# EAGLE design team_flag_jig (EAGLE 6.5.0)
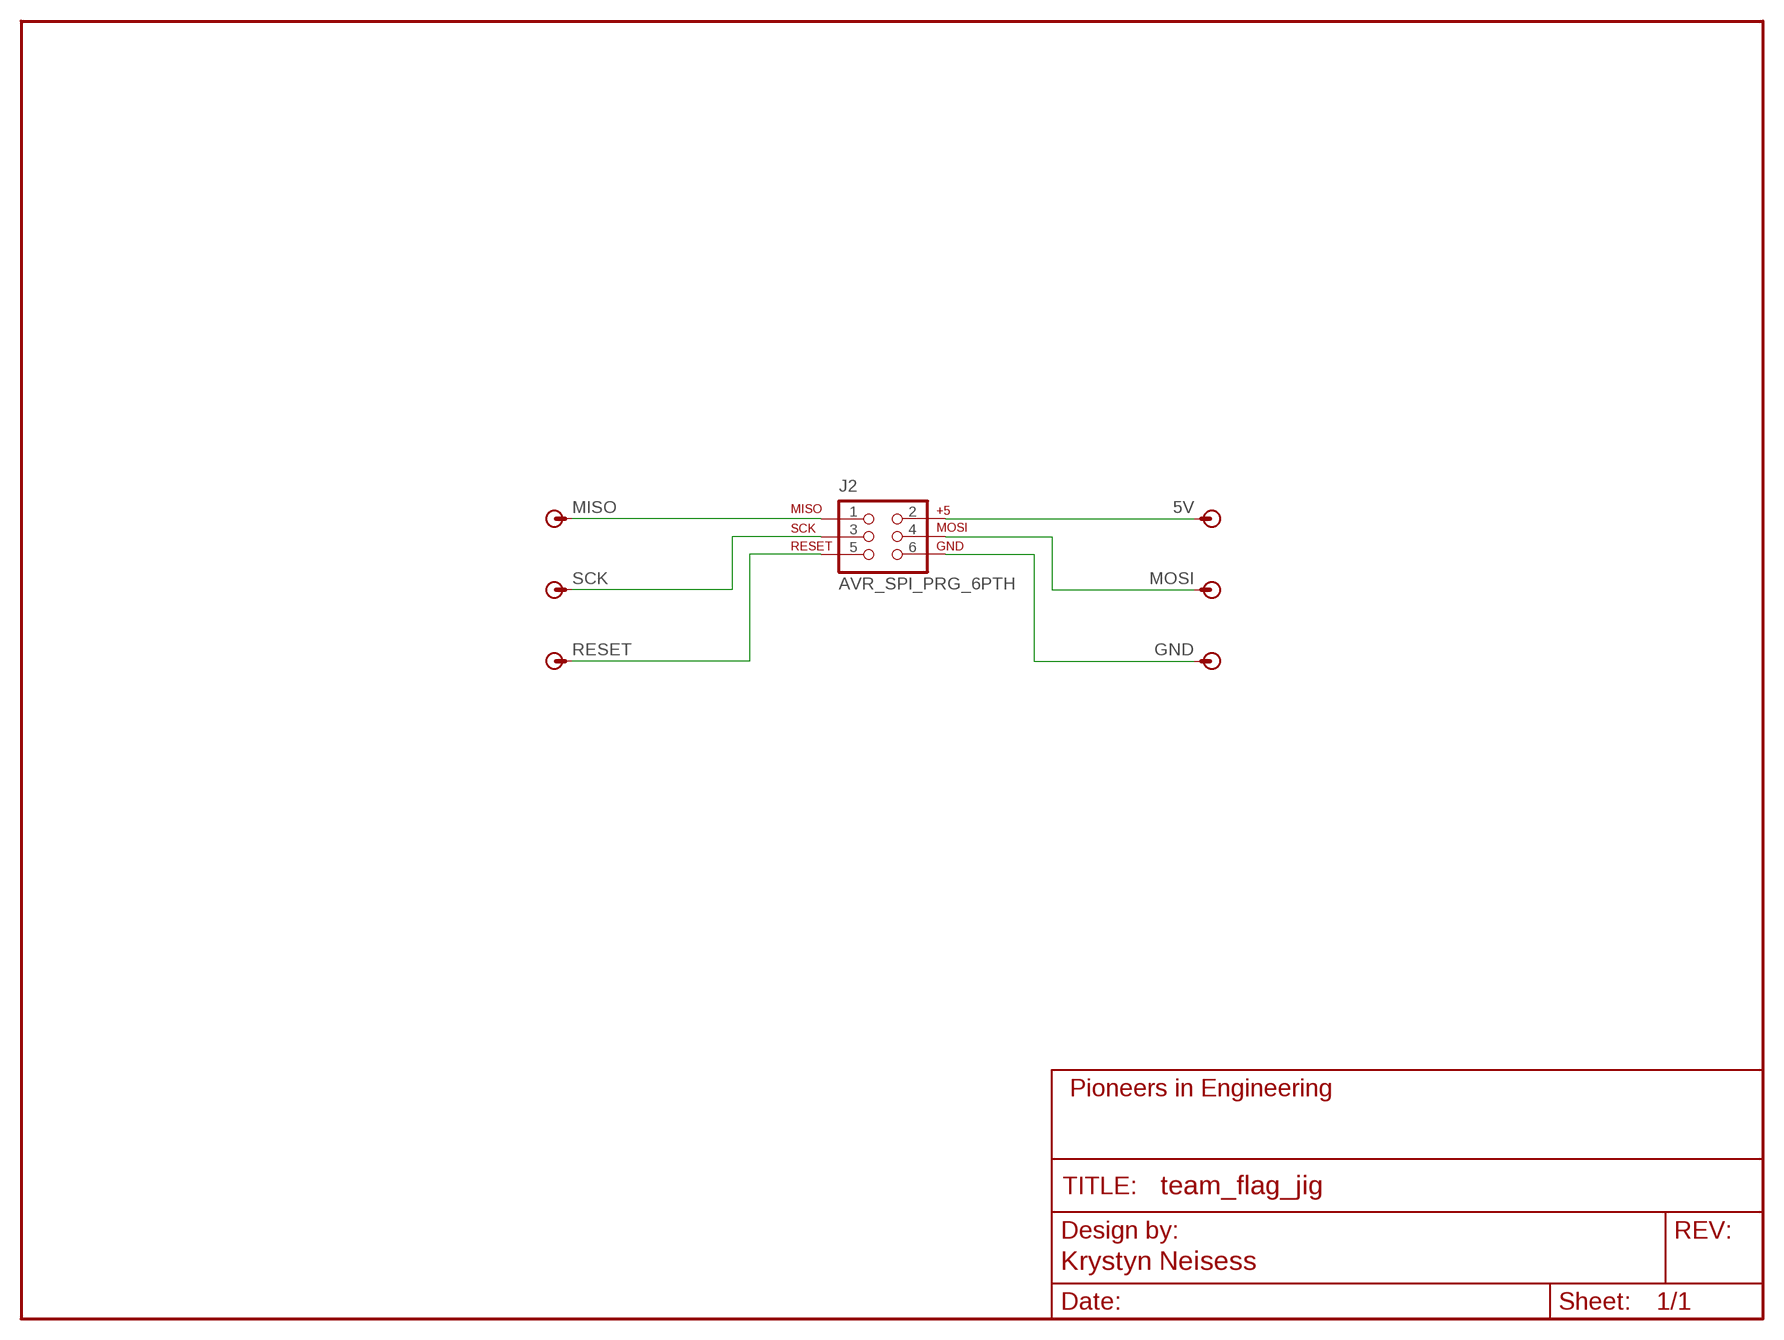
[diagram p0: schematic, sheet 1]
FRAME1 (FRAME-LETTER): AUTHOR: Krystyn Neisess; REVISION: 3A

## Parts
5V  POGO_PIN  [POGO_PIN_394]
GND  POGO_PIN  [POGO_PIN_394]
J2  AVR_SPI_PRG_6PTH  [2X3]
MISO  POGO_PIN  [POGO_PIN_394]
MOSI  POGO_PIN  [POGO_PIN_394]
RESET  POGO_PIN  [POGO_PIN_394]
SCK  POGO_PIN  [POGO_PIN_394]

## Nets
5V: 5V.POGO_PIN J2.2
A: GND.POGO_PIN J2.6
MISO: J2.1 MISO.POGO_PIN
MOSI: J2.4 MOSI.POGO_PIN
RESET: J2.5 RESET.POGO_PIN
SCK: J2.3 SCK.POGO_PIN

## Library data of the parts
5V GND MISO MOSI RESET SCK = pie:POGO_PIN: Pogo Pin Mounting/Probing Pad; PIE-INT-REF-NUM: POGO-PIN
J2 = pie:AVR_SPI_PRG_6: AVR ISP 6 Pin This is the reduced ISP connector for AVR programming. Common on Arduino. This footprint will take up less PCB space and can be used with a 10-pin to 6-pin adapter such as SKU: BOB-08508; PIE-INT-REF-NUM: BULK-STOCK

## Board
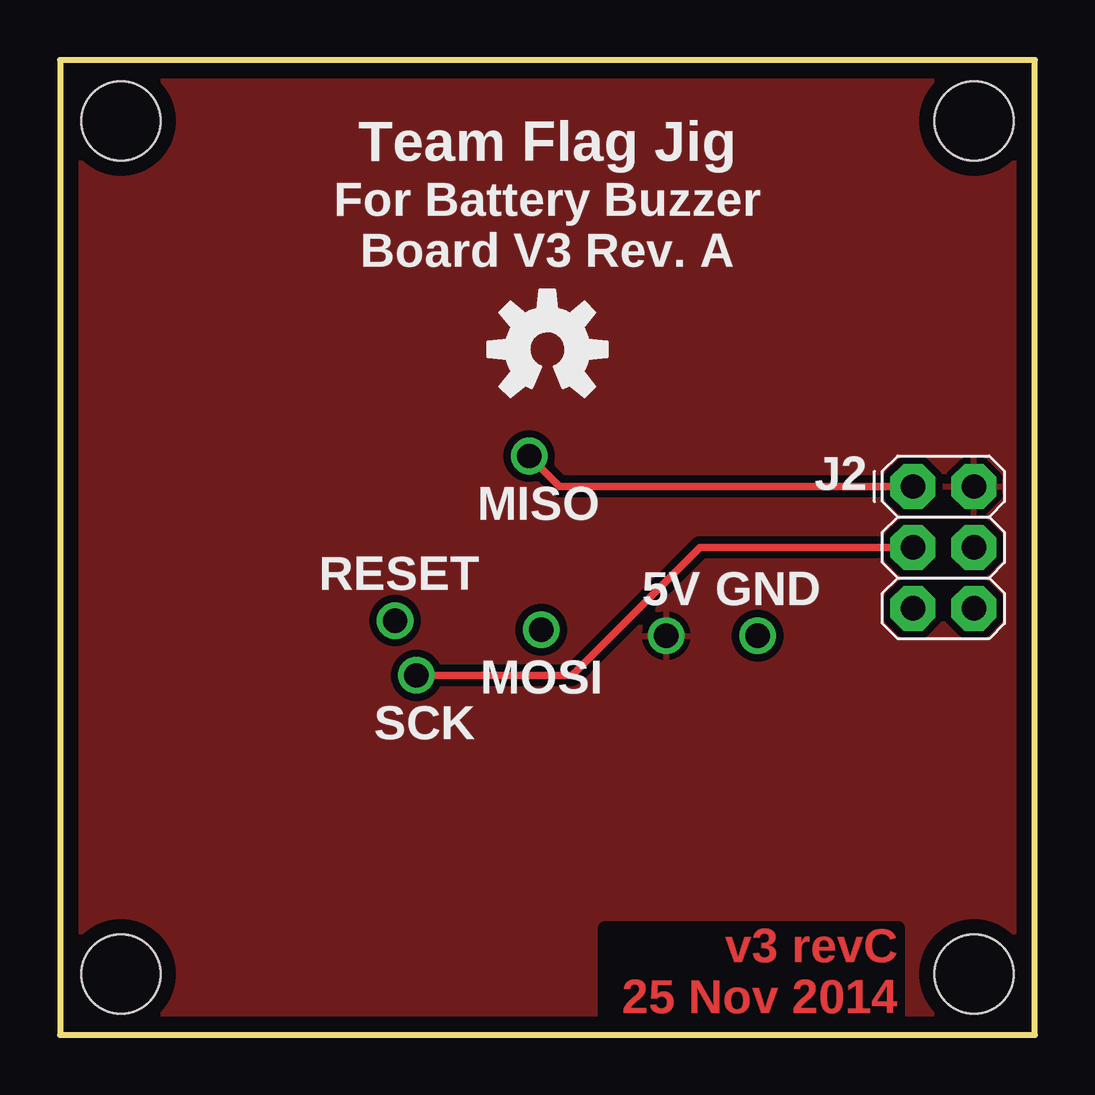
[diagram p1: board, top side]
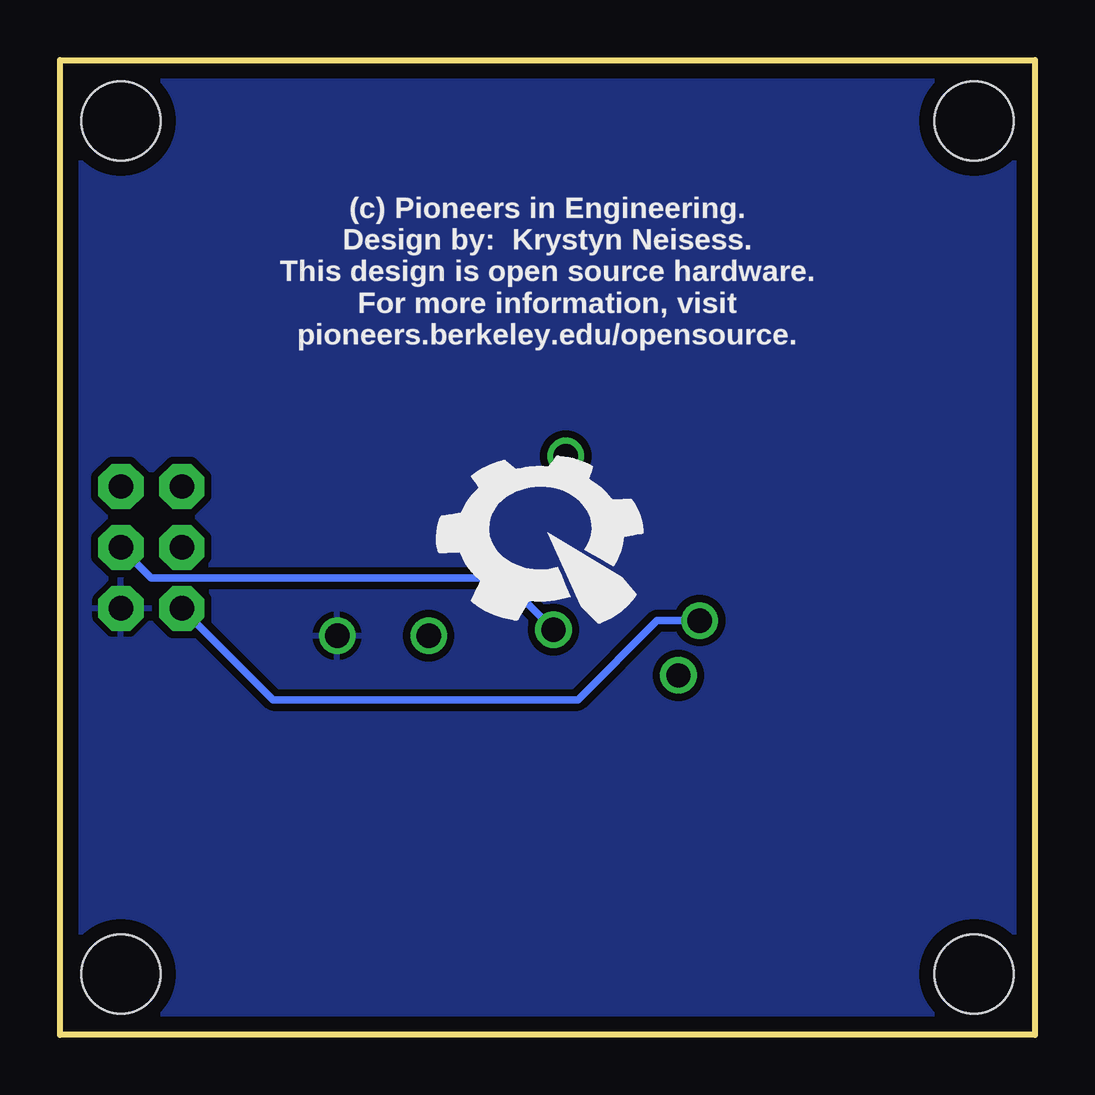
[diagram p2: board, bottom side, seen from below]

Size 40.64 x 40.64 mm. Coordinates in mm from the lower left corner, seen from the top.
Outline: 0,0 40.64,0 40.64,40.64 0,40.64 0,0
Copper layers (1*16): Top 2mil / dielectric 9mil / Bottom 2mil
Design rules "advancedcircuits-33each-pie": minimum track width 6mil, minimum drill 15mil, track to track 6mil, track to pad 6mil, pad to pad 6mil, via to via 6mil, smd to smd 6mil, copper to edge 25mil, drill to drill 7mil, minimum pad ring 7mil, minimum via ring 7mil, stop-mask expansion 3mil, vias tented up to drill 21mil, thermal gap 10mil

### Footprints (pad centres in the part's own frame; a part is rotated, then mirrored left to right if it is on the bottom)
POGO_PIN_394 = drill 1.016 pad 1.524: POGO_PIN 0,0
2X3 = drill 1.016 pad 1.88 octagon: 1 0,0; 2 0,2.54; 3 2.54,0; 4 2.54,2.54; 5 5.08,0; 6 5.08,2.54
STAND-OFF = hole 3.302: 0,0

### Placement (x,y rotation side)
5V  25.27,16.64 270 top
GND  29.08,16.64 90 top
J2  35.56,22.86 270 top
MISO  19.56,24.13 0 top
MOSI  20.07,16.89 0 top
RESET  13.97,17.27 270 top
SCK  14.86,14.99 0 top
U$1  [OSHW-LOGO-M]  20.32,28.57 0 top
U$2  [PIE-LOGO-SMALL]  20.32,20.95 0 bottom
U$3  [STAND-OFF]  38.1,2.54 0 top
U$4  [STAND-OFF]  2.54,38.1 0 top
U$5  [STAND-OFF]  38.1,38.1 0 top
U$6  [STAND-OFF]  2.54,2.54 0 top

### Tracks (layer width: path | path; a pad name or v marks a point on that pad's centre or on a via)
5V
  pour Top (isolate 0.305): 0,0 0,40.64 40.64,40.64 40.64,0
A
  pour Bottom (isolate 0.305): 0,0 0,40.64 40.64,40.64 40.64,0
MISO
  Top 0.305: J2.1 20.83,22.86 MISO.POGO_PIN
MOSI
  Bottom 0.305: J2.4 36.83,19.05 22.23,19.05 MOSI.POGO_PIN
RESET
  Bottom 0.305: J2.5 31.75,13.97 19.05,13.97 15.75,17.27 RESET.POGO_PIN
SCK
  Top 0.305: J2.3 26.67,20.32 21.34,14.99 SCK.POGO_PIN

### Text on the board
Top: v3 revC / 25 Nov 2014
tPlace: Team Flag Jig | For Battery Buzzer / Board V3 Rev. A
bPlace: (c) Pioneers in Engineering. / Design by: Krystyn Neisess. / This design is open source hardware. / For more information, visit / pioneers.berkeley.edu/opensource.